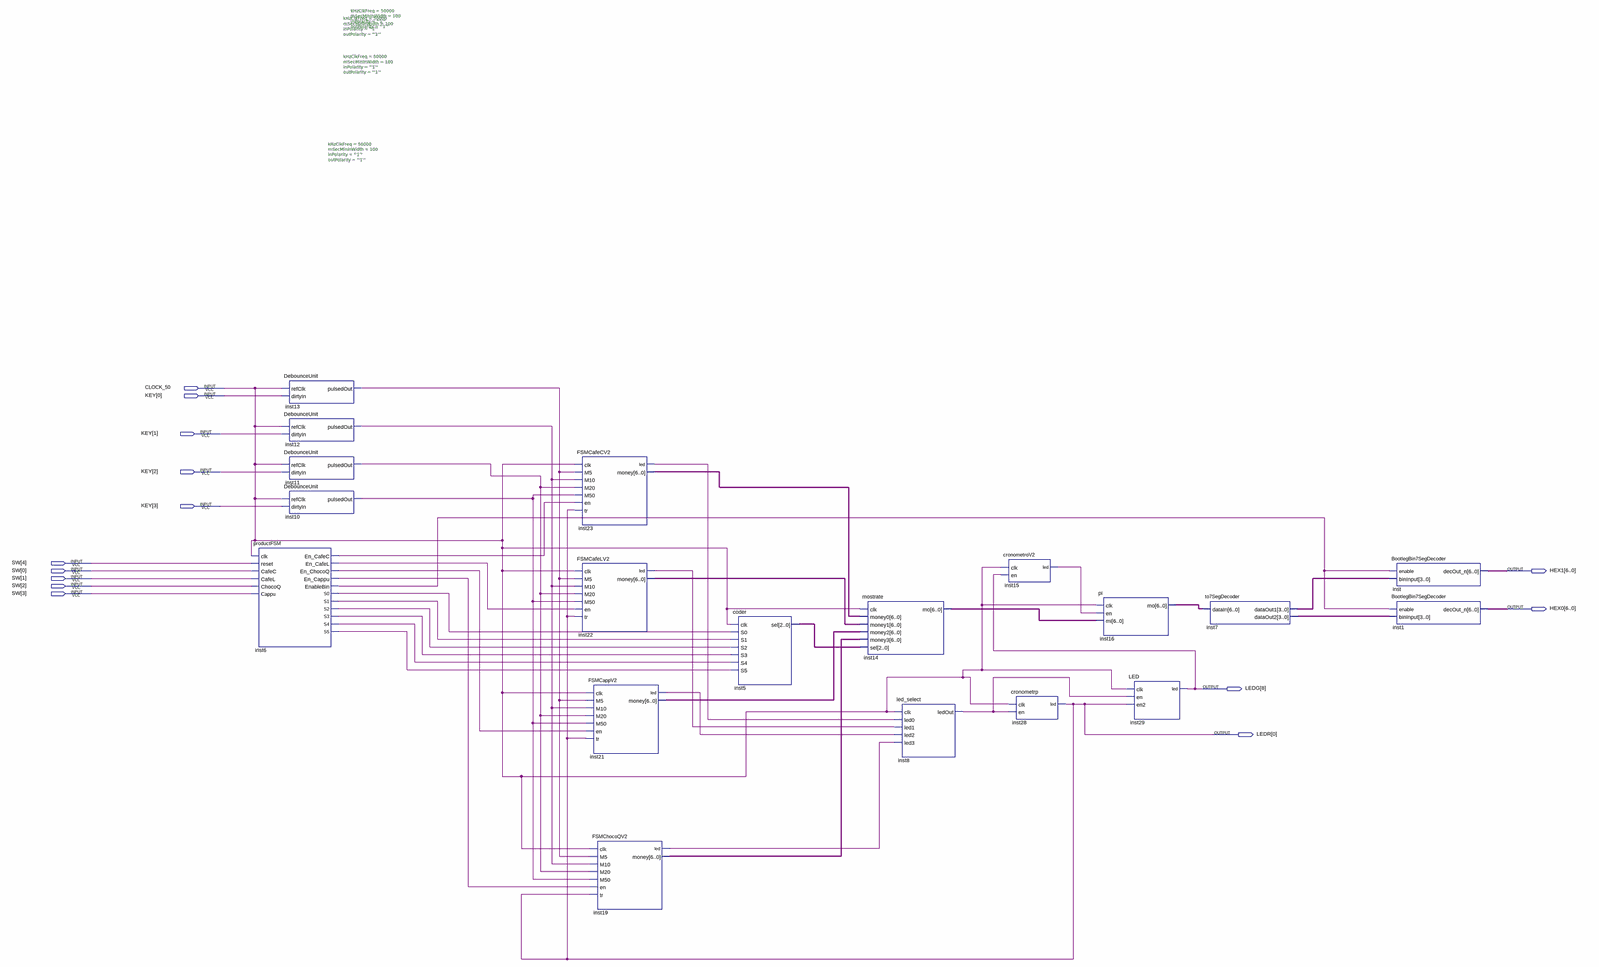
[diagram p0: schematic sheet, whole]
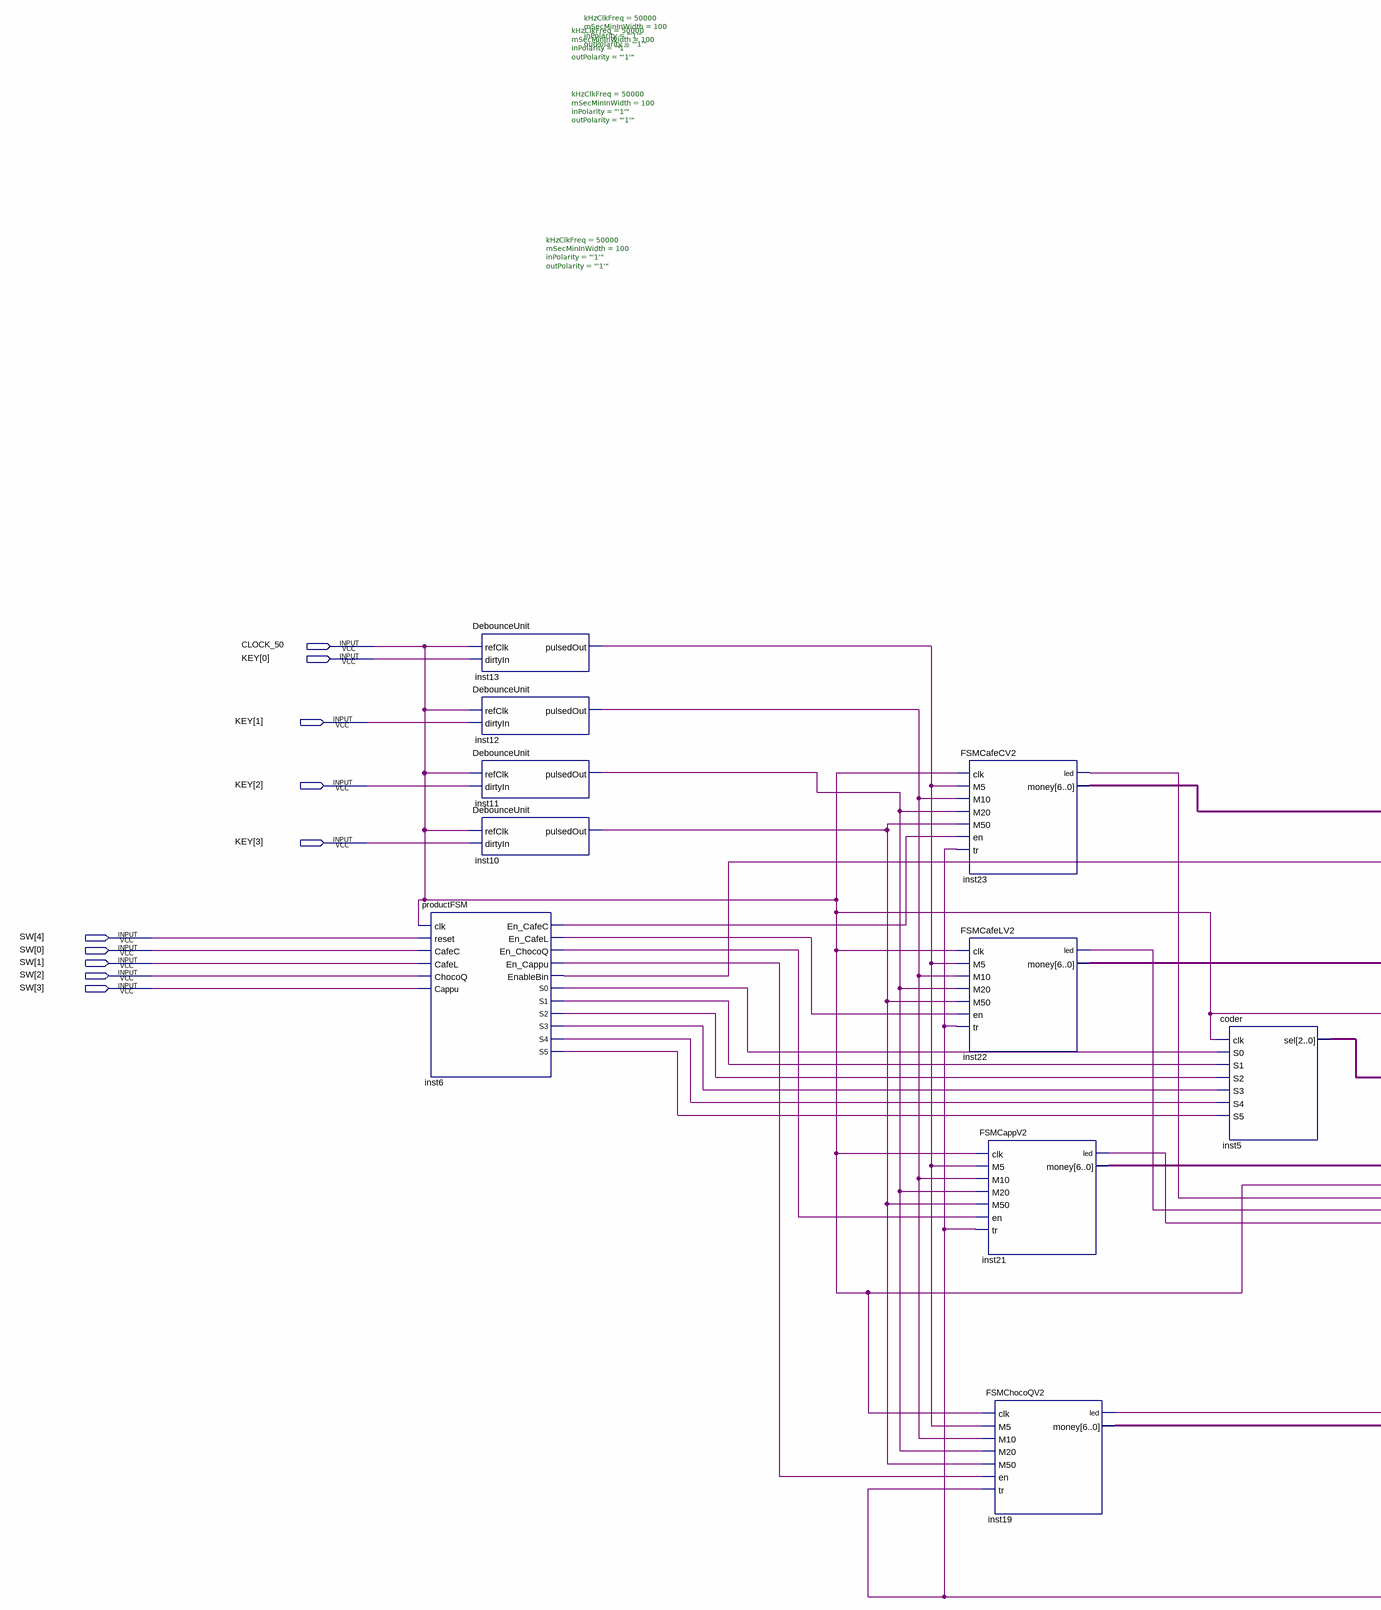
[diagram p1: schematic sheet, left part]
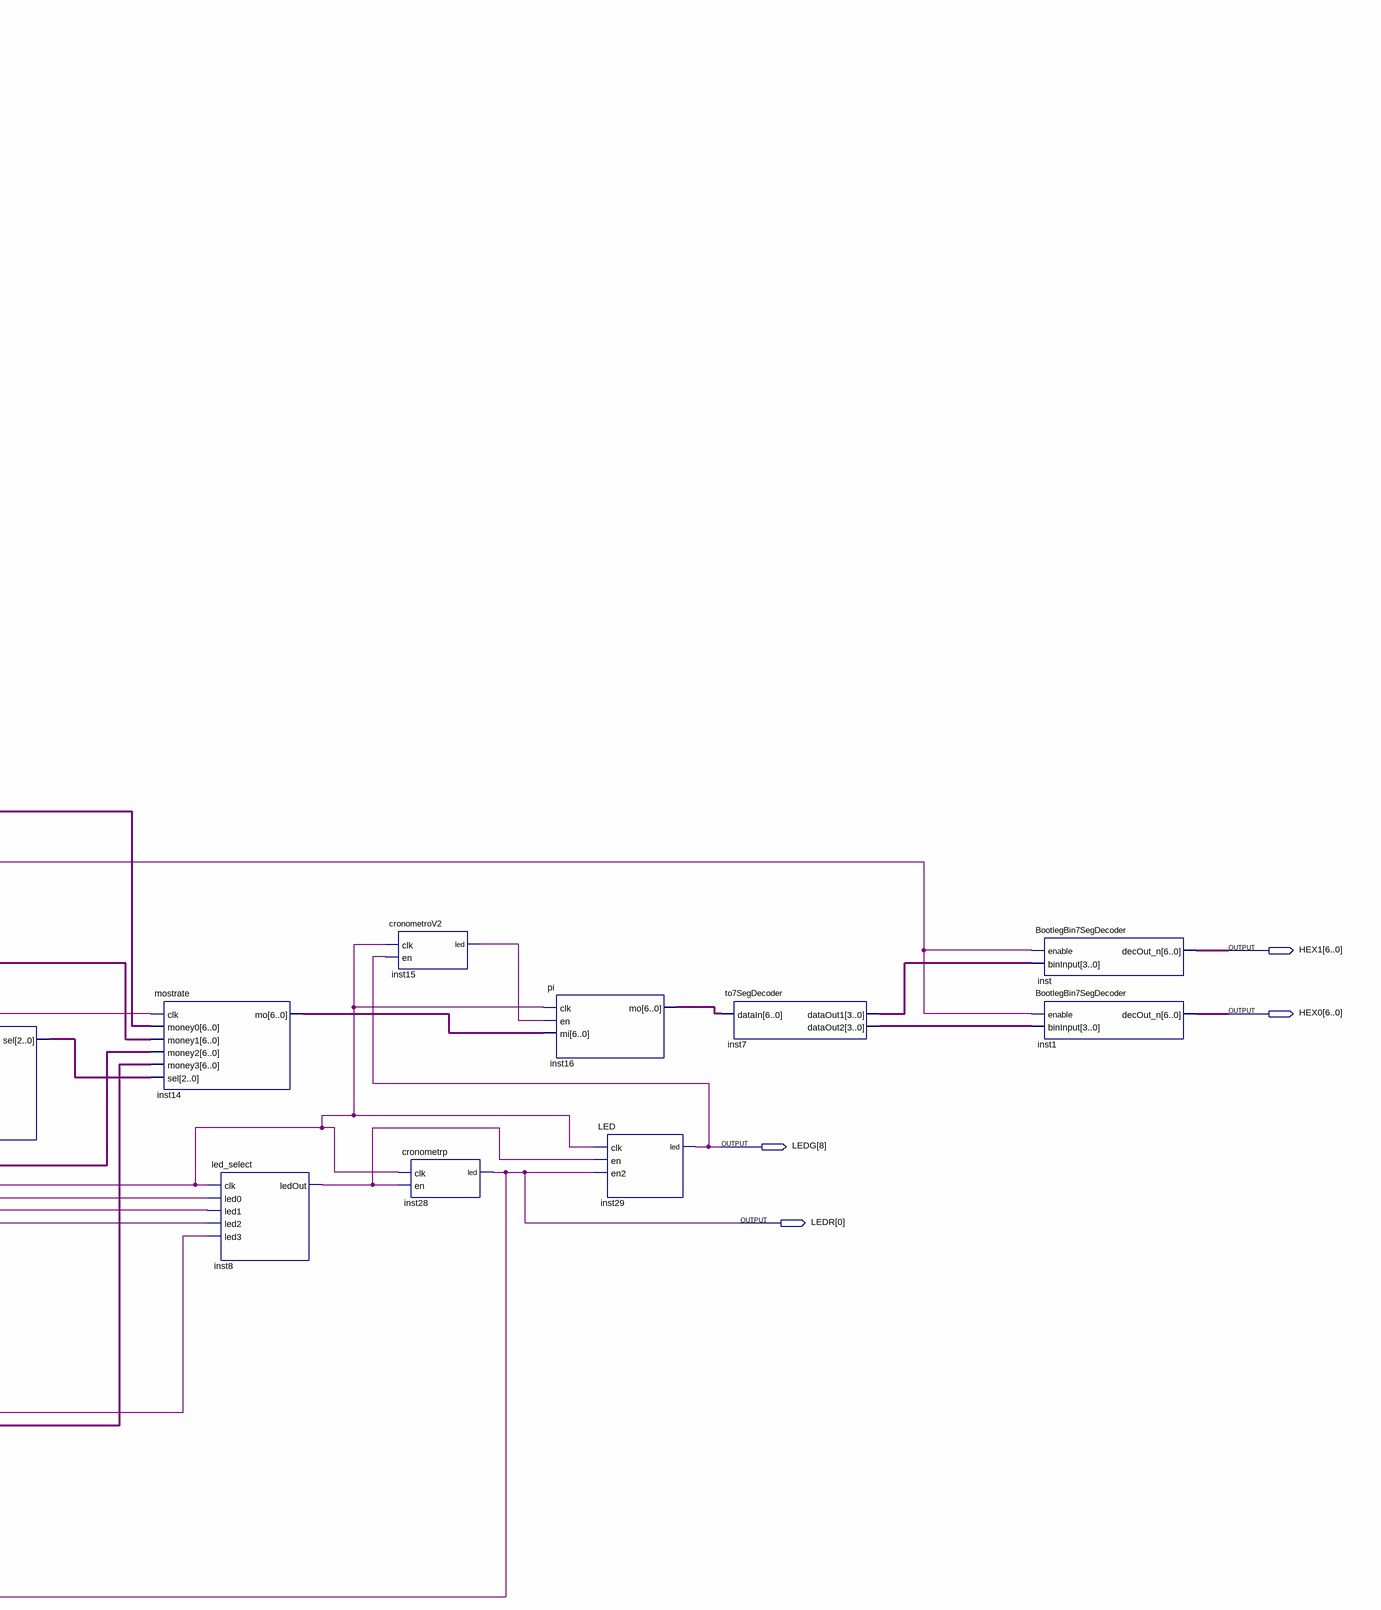
[diagram p2: schematic sheet, right part]
// Quartus schematic test.bdf as structural Verilog: 19 symbols, 14 pins
module test (
  input  CLOCK_50,
  input  [3:0] KEY,
  input  [4:0] SW,
  output [6:0] HEX1,
  output [6:0] HEX0,
  output [8:8] LEDG,
  output [0:0] LEDR
);

  wire inst6_en_cafec, inst6_en_cafel, inst6_en_cappu, inst6_en_chocoq, inst6_enablebin, inst6_s0, inst6_s1,
       inst6_s2, inst6_s3, inst6_s4, inst6_s5, inst8_ledout, inst10_pulsedout, inst11_pulsedout,
       inst12_pulsedout, inst13_pulsedout, inst15_led, inst19_led, inst21_led, inst22_led, inst23_led;
  wire [2:0] inst5_sel;
  wire [3:0] inst7_dataout1, inst7_dataout2;
  wire [6:0] inst14_mo, inst16_mo, inst19_money, inst21_money, inst22_money, inst23_money;

  productFSM inst6 (
    .clk(CLOCK_50), .reset(SW[4]), .CafeC(SW[0]), .CafeL(SW[1]), .ChocoQ(SW[2]), .Cappu(SW[3]),
    .En_CafeC(inst6_en_cafec), .En_CafeL(inst6_en_cafel), .En_ChocoQ(inst6_en_chocoq),
    .En_Cappu(inst6_en_cappu), .EnableBin(inst6_enablebin), .S0(inst6_s0), .S1(inst6_s1), .S2(inst6_s2),
    .S3(inst6_s3), .S4(inst6_s4), .S5(inst6_s5));
  DebounceUnit #(.kHzClkFreq(50000), .mSecMinInWidth(100), .inPolarity("'1'"), .outPolarity("'1'")) inst13 (
    .refClk(CLOCK_50), .dirtyIn(KEY[0]), .pulsedOut(inst13_pulsedout));
  DebounceUnit #(.kHzClkFreq(50000), .mSecMinInWidth(100), .inPolarity("'1'"), .outPolarity("'1'")) inst12 (
    .refClk(CLOCK_50), .dirtyIn(KEY[1]), .pulsedOut(inst12_pulsedout));
  DebounceUnit #(.kHzClkFreq(50000), .mSecMinInWidth(100), .inPolarity("'1'"), .outPolarity("'1'")) inst11 (
    .refClk(CLOCK_50), .dirtyIn(KEY[2]), .pulsedOut(inst11_pulsedout));
  DebounceUnit #(.kHzClkFreq(50000), .mSecMinInWidth(100), .inPolarity("'1'"), .outPolarity("'1'")) inst10 (
    .refClk(CLOCK_50), .dirtyIn(KEY[3]), .pulsedOut(inst10_pulsedout));
  FSMCafeCV2 inst23 (
    .clk(CLOCK_50), .M5(inst13_pulsedout), .M10(inst12_pulsedout), .M20(inst11_pulsedout),
    .M50(inst10_pulsedout), .en(inst6_en_cafec), .tr(LEDR[0]), .led(inst23_led), .money(inst23_money));
  FSMCafeLV2 inst22 (
    .clk(CLOCK_50), .M5(inst13_pulsedout), .M10(inst12_pulsedout), .M20(inst11_pulsedout),
    .M50(inst10_pulsedout), .en(inst6_en_cafel), .tr(LEDR[0]), .led(inst22_led), .money(inst22_money));
  FSMCappV2 inst21 (
    .clk(CLOCK_50), .M5(inst13_pulsedout), .M10(inst12_pulsedout), .M20(inst11_pulsedout),
    .M50(inst10_pulsedout), .en(inst6_en_chocoq), .tr(LEDR[0]), .led(inst21_led), .money(inst21_money));
  FSMChocoQV2 inst19 (
    .clk(CLOCK_50), .M5(inst13_pulsedout), .M10(inst12_pulsedout), .M20(inst11_pulsedout),
    .M50(inst10_pulsedout), .en(inst6_en_cappu), .tr(LEDR[0]), .led(inst19_led), .money(inst19_money));
  coder inst5 (
    .clk(CLOCK_50), .S0(inst6_s0), .S1(inst6_s1), .S2(inst6_s2), .S3(inst6_s3), .S4(inst6_s4), .S5(inst6_s5),
    .sel(inst5_sel));
  mostrate inst14 (
    .clk(CLOCK_50), .money0(inst23_money), .money1(inst22_money), .money2(inst21_money),
    .money3(inst19_money), .sel(inst5_sel), .mo(inst14_mo));
  led_select inst8 (
    .clk(CLOCK_50), .led0(inst23_led), .led1(inst22_led), .led2(inst21_led), .led3(inst19_led),
    .ledOut(inst8_ledout));
  cronometroV2 inst15 (.clk(CLOCK_50), .en(LEDG[8]), .led(inst15_led));
  cronometrp inst28 (.clk(CLOCK_50), .en(inst8_ledout), .led(LEDR[0]));
  pi inst16 (.clk(CLOCK_50), .en(inst15_led), .mi(inst14_mo), .mo(inst16_mo));
  LED inst29 (.clk(CLOCK_50), .en(inst8_ledout), .en2(LEDR[0]), .led(LEDG[8]));
  to7SegDecoder inst7 (.dataIn(inst16_mo), .dataOut1(inst7_dataout1), .dataOut2(inst7_dataout2));
  BootlegBin7SegDecoder inst (.enable(inst6_enablebin), .binInput(inst7_dataout1), .decOut_n(HEX1));
  BootlegBin7SegDecoder inst1 (.enable(inst6_enablebin), .binInput(inst7_dataout2), .decOut_n(HEX0));
endmodule
